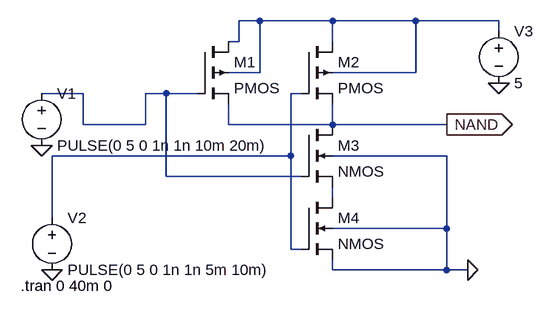
[diagram p0: schematic CMOS NAND.asc]
CMOS NAND.asc, the LTspice schematic file:
Version 4.1
SHEET 1 880 680
WIRE 96 -16 64 -16
WIRE 208 -16 96 -16
WIRE 336 -16 208 -16
WIRE 464 -16 336 -16
WIRE 464 0 464 -16
WIRE 64 16 64 -16
WIRE 64 16 48 16
WIRE 208 16 208 -16
WIRE 96 64 96 -16
WIRE 96 64 48 64
WIRE 336 64 336 -16
WIRE 336 64 208 64
WIRE -176 96 -240 96
WIRE -48 96 -80 96
WIRE 0 96 -48 96
WIRE 160 96 144 96
WIRE -176 144 -176 96
WIRE -80 144 -80 96
WIRE -80 144 -176 144
WIRE 48 144 48 112
WIRE 208 144 208 112
WIRE 208 144 48 144
WIRE 384 144 208 144
WIRE 144 192 144 96
WIRE 144 192 -224 192
WIRE 384 192 208 192
WIRE -48 224 -48 96
WIRE 160 224 -48 224
WIRE 208 256 208 240
WIRE -224 288 -224 192
WIRE 384 304 384 192
WIRE 384 304 208 304
WIRE 144 336 144 192
WIRE 160 336 144 336
WIRE 208 368 208 352
WIRE 384 368 384 304
WIRE 384 368 208 368
WIRE 416 368 384 368
FLAG 384 144 NAND
IOPIN 384 144 Out
FLAG 416 368 0
FLAG -240 176 0
FLAG -224 368 0
FLAG 464 80 0
SYMBOL pmos4 0 16 R0
SYMATTR InstName M1
SYMBOL pmos4 160 16 R0
SYMATTR InstName M2
SYMBOL nmos4 160 144 R0
SYMATTR InstName M3
SYMBOL nmos4 160 256 R0
SYMATTR InstName M4
SYMBOL voltage -240 80 R0
SYMATTR InstName V1
SYMATTR Value PULSE(0 5 0 1n 1n 10m 20m)
SYMBOL voltage -224 272 R0
SYMATTR InstName V2
SYMATTR Value PULSE(0 5 0 1n 1n 5m 10m)
SYMBOL voltage 464 -16 R0
SYMATTR InstName V3
SYMATTR Value 5
TEXT -272 392 Left 2 !.tran 0 40m 0

The netlist it stands for:
* CMOS NAND.asc
M1 N001 N002 NAND N001 PMOS
M2 N001 N003 NAND N001 PMOS
M3 NAND N002 N004 0 NMOS
M4 N004 N003 0 0 NMOS
V1 N002 0 PULSE(0 5 0 1n 1n 10m 20m)
V2 N003 0 PULSE(0 5 0 1n 1n 5m 10m)
V3 N001 0 5
.model NMOS NMOS
.model PMOS PMOS
.lib standard.mos
.tran 0 40m 0
.backanno
.end